# EAGLE design CAN_arduino_shield (EAGLE 7.2.0)
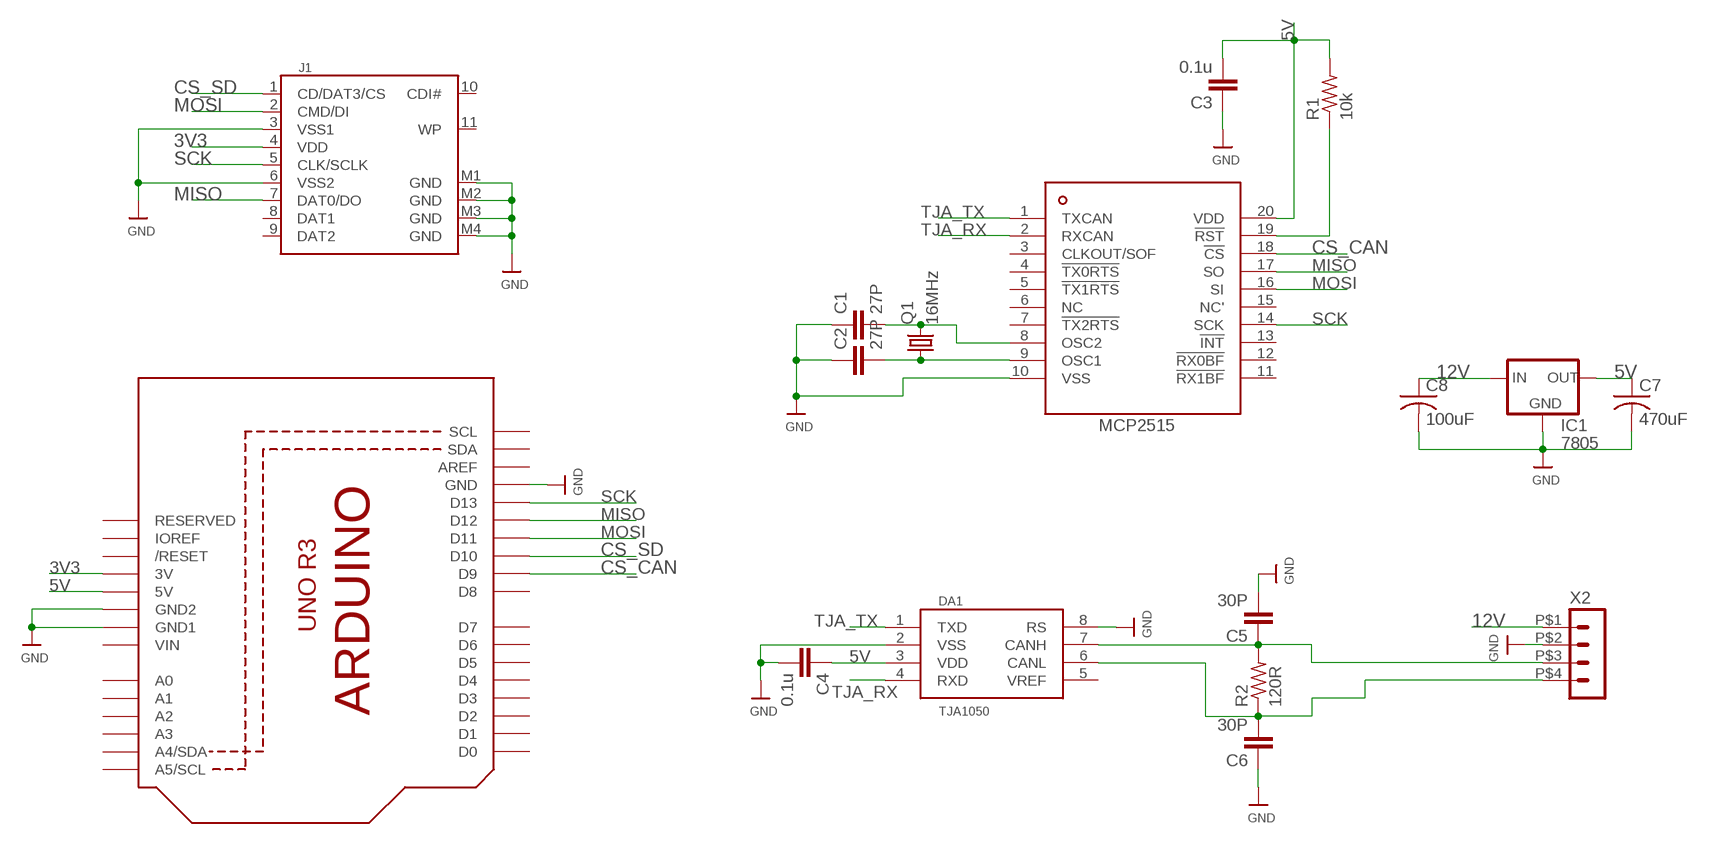
[diagram p0: schematic, sheet 1]

## Parts
C1  27P  C-EUC0805  [C0805]
C2  27P  C-EUC0805  [C0805]
C3  0.1u  C-EUC0805  [C0805]
C4  0.1u  C-EUC0805  [C0805]
C5  30P  C-EUC0805  [C0805]
C6  30P  C-EUC0805  [C0805]
C7  470uF  C-US025-050X050  [C025-050X050]
C8  100uF  C-US025-050X050  [C025-050X050]
DA1  TJA1050  [SO08]
IC1  7805  78XXS  [78XXS]
J1  SDCARD  [SDCMF-10915W010]
Q1  16MHz  CRYSTALHC49S  [HC49/S]
R1  10k  R-US_M0805  [M0805]
R2  120R  R-US_M0805  [M0805]
U1  ARDUINOR3-BPLACE  [ARDUINOR3-BPLACE]
U$1  MCP2515  [TSSOP20]
X2  HEADER_POS4_43045-0412  [43045-0412]

## Nets
3V3: J1.4(VDD) U1.3V
5V: C3.2 C4.1 C7.1 DA1.3(VDD) IC1.OUT R1.2 U1.5V U$1.20(VDD)
12V: C8.1 IC1.IN X2.P$1
CS_CAN: U1.D9 U$1.18(!CS)
CS_SD: J1.1(CD/DAT3/CS) U1.D10
GND: C1.1 C2.1 C3.1 C4.2 C5.2 C6.1 C7.2 C8.2 DA1.2(VSS) DA1.8(RS) IC1.GND J1.3(VSS1) J1.6(VSS2) J1.M1(GND) J1.M2(GND) J1.M3(GND) J1.M4(GND) U1.GND U1.GND1 U1.GND2 U$1.10(VSS) X2.P$2
MISO: J1.7(DAT0/DO) U1.D12 U$1.17(SO)
MOSI: J1.2(CMD/DI) U1.D11 U$1.16(SI)
N$1: C1.2 Q1.2 U$1.8(OSC2)
N$2: C2.2 Q1.1 U$1.9(OSC1)
N$3: C5.1 DA1.7(CANH) R2.2 X2.P$3
N$4: C6.2 DA1.6(CANL) R2.1 X2.P$4
N$5: R1.1 U$1.19(!RST)
SCK: J1.5(CLK/SCLK) U1.D13 U$1.14(SCK)
TJA_RX: DA1.4(RXD) U$1.2(RXCAN)
TJA_TX: DA1.1(TXD) U$1.1(TXCAN)
Unconnected: DA1.5(VREF) J1.8(DAT1) J1.9(DAT2) J1.10(CDI#) J1.11(WP) U1.A0 U1.A1 U1.A2 U1.A3 U1.A4(A4/SDA) U1.A5(A5/SCL) U1.AREF U1.D0 U1.D1 U1.D2 U1.D3 U1.D4 U1.D5 U1.D6 U1.D7 U1.D8 U1.IOREF U1.RESERVED U1.RESET(/RESET) U1.SCL U1.SDA U$1.3(CLKOUT/SOF) U$1.4(!TX0RTS) U$1.5(!TX1RTS) U$1.6(NC) U$1.7(!TX2RTS) U$1.11(!RX1BF) U$1.12(!RX0BF) U$1.13(!INT) U$1.15(NC')

## Power pins joined to a net without a drawn wire
VIN: U1.VIN

## Library data of the parts
C1-C6 = rcl:C-EU: CAPACITOR, European symbol
C7 C8 = rcl:C-US: CAPACITOR, American symbol
DA1 = can_driver:TJA1050: High speed CAN transceiver Input levels compatible with 3.3 V and 5 V devices 5V supply
IC1 = v-reg:78XXS: VOLTAGE REGULATOR
J1 = sd-mmc:SDCARD: SD card connector KINGFONT SDCMF-10915W010
Q1 = crystal:CRYSTAL: CRYSTAL; OC_FARNELL: 1667008; OC_NEWARK: unknown
R1 R2 = rcl:R-US_: RESISTOR, American symbol
U1 = microbuilder:ARDUINOR3: This is a new object for the new Arduino R3 - with extra pins that you may want to use (such as IOref, and duplicated A4/A5
U$1 = MCP2515:MCP2515: Microchip Technology’s MCP2515 is a stand-alone Controller Area Network (CAN) controller that implements the CAN specification, version 2.0B. It is capable of transmitting and receiving both standard and extended data and remote frames. The MCP2515 has two acceptance masks and six acceptance filters that are used to filter out unwanted messages, thereby reducing the host MCUs overhead. The MCP2515 interfaces with microcontrollers (MCUs) via an industry standard Serial Peripheral Interface (SPI).
X2 = con-molex-micro-fit-3_0:HEADER_POS4_?: Molex - Micro-Fit 3.0 Series connector, 3.00mm (0.118") pitch header, 4 positions.

## Board
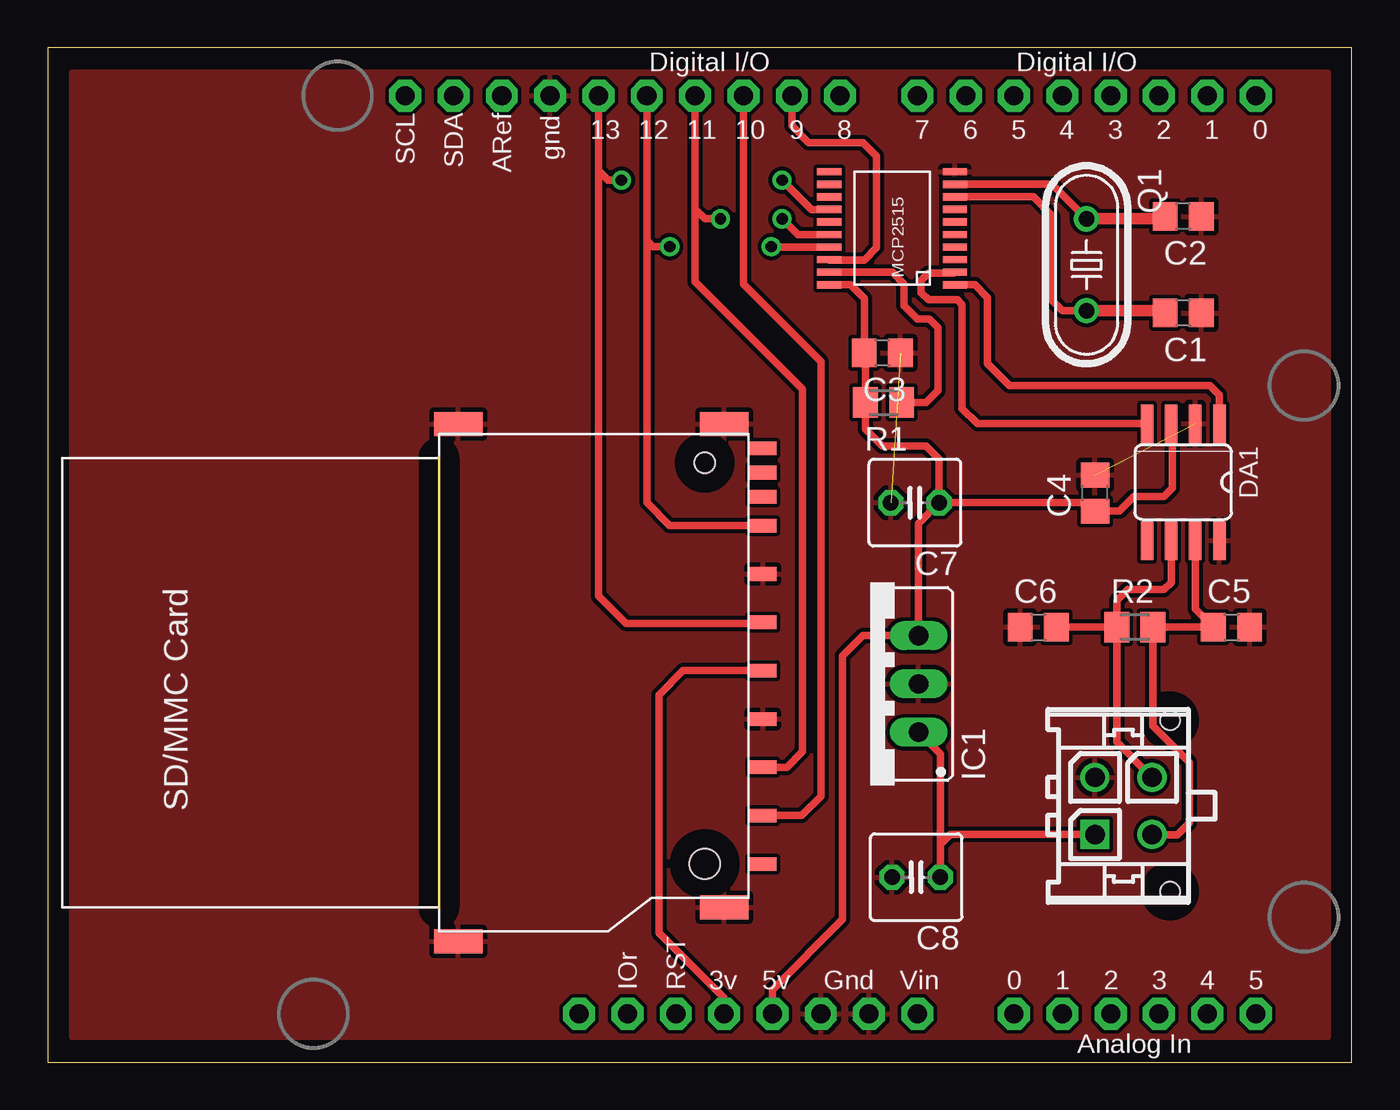
[diagram p1: board, top side]
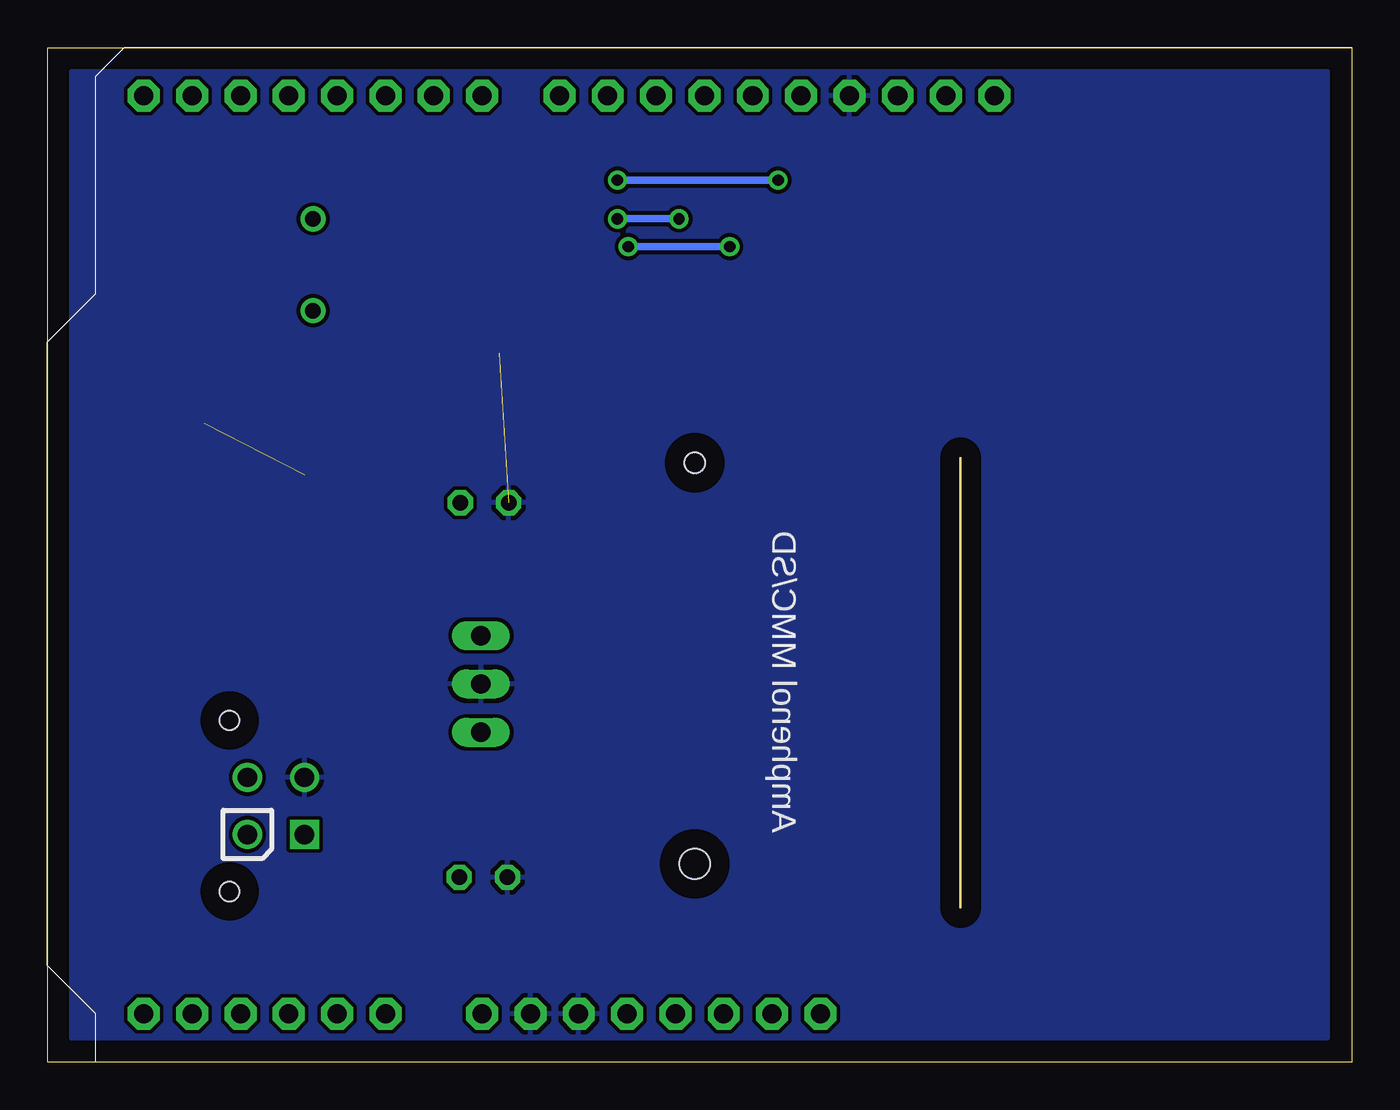
[diagram p2: board, bottom side, seen from below]

Size 68.56 x 53.33 mm. Coordinates in mm from the lower left corner, seen from the top.
Outline: 0,0 68.56,0 68.56,53.33 0,53.33 0,0
Copper layers (1*16): Top 0.035mm / dielectric 1.5mm / Bottom 0.035mm
Design rules "default": minimum track width 10mil, minimum drill 24mil, track to track 8mil, track to pad 8mil, pad to pad 8mil, via to via 8mil, smd to smd 8mil, copper to edge 40mil, drill to drill 8mil, minimum pad ring 10mil, minimum via ring 8mil, stop-mask expansion 4mil, vias tented up to drill 0mil, thermal gap 10mil

### Footprints (pad centres in the part's own frame; a part is rotated, then mirrored left to right if it is on the bottom)
C0805 = smd 1.3 x 1.5: 1 -0.95,0; 2 0.95,0
C025-050X050 = drill 0.813 octagon: 1 -1.27,0; 2 1.27,0
SO08 = smd 0.66 x 2.032: 1 -1.905,-3.073; 2 -0.635,-3.073; 3 0.635,-3.073; 4 1.905,-3.073; 5 1.905,3.073; 6 0.635,3.073; 7 -0.635,3.073; 8 -1.905,3.073
78XXS = drill 1.016 long: GND 0,-2.54; IN -2.54,-2.54; OUT 2.54,-2.54
SDCMF-10915W010 = smd 0.711 x 1.422: 1 7.366,13.462; 2 4.826,13.462; 3 2.286,13.462; 4 -0.254,13.462; 5 -2.794,13.462; 6 -5.334,13.462; 7 -7.874,13.462; 8 -9.398,13.462; 9 9.906,13.462; 10 -11.938,13.462; 11 -10.668,13.462 | smd 1.27 x 2.54: M1 12.192,11.43; M2 13.97,-2.54; M3 -13.208,-2.54; M4 -13.208,11.43 | hole 1.6: 9.906,10.414 | hole 1.1: -11.176,10.414
HC49/S = drill 0.813: 1 -2.413,0; 2 2.413,0
M0805 = smd 1.3 x 1.6: 1 -0.95,0; 2 0.95,0
ARDUINOR3-BPLACE = drill 1 pad 1.676 octagon: 3V 35.56,2.54; 5V 38.1,2.54; A0 50.8,2.54; A1 53.34,2.54; A2 55.88,2.54; A3 58.42,2.54; A4 60.96,2.54; A5 63.5,2.54; AREF 23.876,50.8; D0 63.5,50.8; D1 60.96,50.8; D2 58.42,50.8; D3 55.88,50.8; D4 53.34,50.8; D5 50.8,50.8; D6 48.26,50.8; D7 45.72,50.8; D8 41.656,50.8; D9 39.116,50.8; D10 36.576,50.8; D11 34.036,50.8; D12 31.496,50.8; D13 28.956,50.8; GND 26.416,50.8; GND1 43.18,2.54; GND2 40.64,2.54; IOREF 30.48,2.54; RESERVED 27.94,2.54; RESET 33.02,2.54; SCL 18.796,50.8; SDA 21.336,50.8; VIN 45.72,2.54
TSSOP20 = smd 1.27 x 0.381: 1 -3.302,2.642; 2 -3.302,1.981; 3 -3.302,1.321; 4 -3.302,0.66; 5 -3.302,0; 6 -3.302,-0.66; 7 -3.302,-1.321; 8 -3.302,-1.981; 9 -3.302,-2.642; 10 -3.302,-3.302; 11 3.302,-3.302; 12 3.302,-2.642; 13 3.302,-1.981; 14 3.302,-1.321; 15 3.302,-0.66; 16 3.302,0; 17 3.302,0.66; 18 3.302,1.321; 19 3.302,1.981; 20 3.302,2.642
43045-0412 = drill 1.02 square: P$1 1.5,0 | drill 1.02: P$2 -1.5,0; P$3 1.5,3; P$4 -1.5,3 | hole 1.02: 4.5,3.94; -4.5,3.94

### Placement (x,y rotation side)
C1  59.69,39.37 180 top
C2  59.69,44.45 180 top
C3  43.88,37.27 180 top
C4  55.05,29.91 90 top
C5  62.23,22.86 0 top
C6  52.07,22.86 0 top
C7  45.59,29.4 180 top
C8  45.66,9.72 180 top
DA1  59.69,30.48 180 top
IC1  43.24,19.88 90 top
J1  24.13,20.32 270 top
Q1  54.61,41.91 270 top
R1  43.94,34.67 180 top
R2  57.15,22.86 0 top
U1  0,0 0 top
U$1  44.39,43.5 180 top
X2  55.05,13.46 270 top

### Tracks (layer width: path | path; a pad name or v marks a point on that pad's centre or on a via)
3V3
  Top 0.406: U1.3V 35.56,3.37 32.13,6.79 32.13,19.3 33.4,20.57 J1.4
5V
  Top 0.406: C7.1 54.61,29.4 C4.1 56.33,28.96 57.09,29.72 58.67,29.72 59.12,30.16 59.12,33.49 DA1.3 | C7.1 45.78,28.32 IC1.OUT 42.86,22.41 41.78,21.34 41.78,7.49 38.1,3.81 U1.5V | U$1.20 42.2,40.86 42.93,40.13 C3.2 42.99,37.21 R1.2 42.99,33.27 43.88,32.38 46.17,32.38 46.86,31.69 C7.1
12V
  Top 0.406: C8.1 46.93,11.43 | 46.93,11.43 46.93,16.19 IC1.IN | X2.P$1 47.46,11.96 46.93,11.43
CS_CAN
  Top 0.406: U1.D9 39.12,49.21 40.01,48.32 42.86,48.32 43.56,47.62 43.56,42.8 42.93,42.16 41.1,42.16 U$1.18
CS_SD
  Top 0.406: U1.D10 36.58,40.89 40.64,36.83 40.64,13.97 39.62,12.95 J1.1
GND  (2 unrouted)
  pour Top: 1.27,52.07 67.31,52.07 67.31,20.32 67.31,1.27 1.27,1.27
  pour Bottom: 1.27,52.07 67.31,52.07 67.31,1.27 1.27,1.27
MISO  (via drill 0.6)
  Top 0.406: U1.D12 31.5,43.18 | 31.5,43.18 31.5,29.4 32.7,28.19 J1.7 | v32.7,42.86 31.81,42.86 31.5,43.18 | U$1.17 38.06,42.84 v38.04,42.86
  Bottom 0.406: v38.04,42.86 v32.7,42.86
MOSI  (via drill 0.6)
  Top 0.406: U1.D11 34.04,44.83 | 34.04,44.83 34.04,41.02 39.69,35.37 39.69,16.32 38.86,15.49 J1.2 | U$1.16 39.43,43.5 v38.61,44.32 | v35.37,44.32 34.54,44.32 34.04,44.83
  Bottom 0.406: v38.61,44.32 v35.37,44.32
N$1
  Top 0.406: U$1.8 51.8,45.48 52.83,44.45 52.83,40 53.34,39.5 Q1.2
  Top 0.61: Q1.2 58.74,39.5 C1.2
N$2
  Top 0.406: U$1.9 52.79,46.14 Q1.1
  Top 0.61: Q1.1 58.74,44.32 C2.2
N$3
  Top 0.406: DA1.7 60.33,23.81 C5.1 R2.2 58.1,17.66 60.01,15.75 60.01,12.57 59.37,11.94 58.08,11.94 X2.P$3
N$4
  Top 0.406: R2.1 56.2,24.26 56.77,24.83 58.67,24.83 59.06,25.21 DA1.6 | R2.1 C6.2 | R2.1 56.2,16.82 X2.P$4
N$5
  Top 0.406: U$1.19 44.4,41.52 45.02,40.89 45.02,39.75 45.72,39.05 46.36,39.05 46.8,38.61 46.8,35.31 46.17,34.67 R1.1
SCK  (via drill 0.6)
  Top 0.406: U1.D13 28.96,46.86 | 28.96,46.86 28.96,24.51 30.42,23.05 37.53,23.05 J1.5 | U$1.14 40.15,44.82 v38.61,46.35 | v30.16,46.35 29.46,46.35 28.96,46.86
  Bottom 0.406: v38.61,46.35 v30.16,46.35
TJA_RX
  Top 0.406: DA1.4 48.87,33.55 48.07,34.35 48.07,39.81 47.82,40.07 46.29,40.07 45.91,40.45 45.91,41.08 46.29,41.47 47.64,41.47 U$1.2
TJA_TX
  Top 0.406: U$1.1 48.74,40.86 49.4,40.2 49.4,36.7 50.55,35.56 61.09,35.56 61.6,35.05 DA1.1